# Altium schematic sheet thermistor-input.SchDoc: Thermistor Input
size A4; DrawnBy: B. Almeida, D. Vogel; Organization: UTAT SS; Revision: 1.1
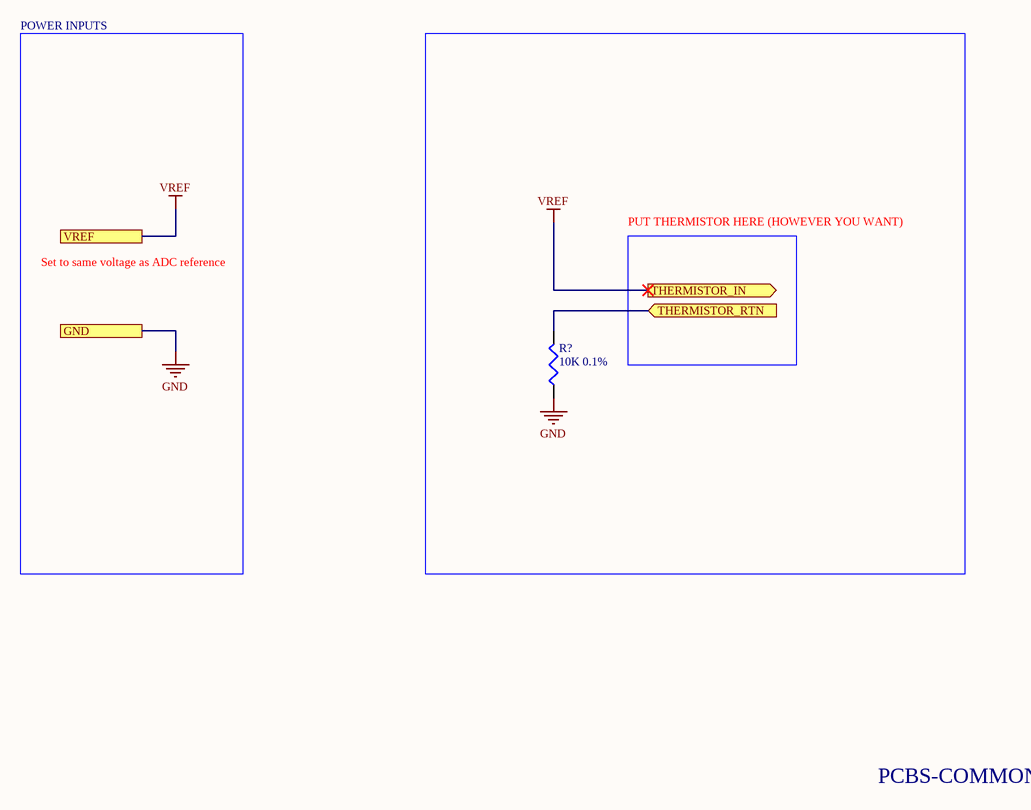
[diagram p0: thermistor-input.SchDoc]

## Parts
R?  10K 0.1%  [J1-0603]

## Blocks framed on the sheet
PUT THERMISTOR HERE (HOWEVER YOU WANT): R?

## Ports
GND, THERMISTOR_IN (out), THERMISTOR_RTN (in), VREF

## Nets
GND: R?.1 ; port GND
VREF: port VREF, port THERMISTOR_IN
THERMISTOR_RTN: R?.2 ; port THERMISTOR_RTN

## Notes on the sheet
- POWER INPUTS
- Set to same voltage as ADC reference
- PCBS-COMMON

## Library data of the parts
R? = Res3: Resistor; Published: 8-Jun-2000; LatestRevisionDate: 29-May-2009; LatestRevisionNote: IPC-7351 Footprint Added.; PackageReference: J1-0603; Publisher: Altium Limited; PackageDescription: Chip Resistor; Value: 10K 0.1%